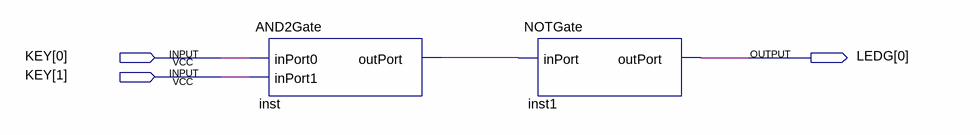
[diagram p0: schematic sheet]
// Quartus schematic NAND2Gate_1.bdf as structural Verilog: 2 symbols, 3 pins
module NAND2Gate_1 (
  input  [1:0] KEY,
  output [0:0] LEDG
);

  wire inst_outport;

  AND2Gate inst (.inPort0(KEY[0]), .inPort1(KEY[1]), .outPort(inst_outport));
  NOTGate inst1 (.inPort(inst_outport), .outPort(LEDG[0]));
endmodule
